# Altium project CSN_v4_2.PrjPCB
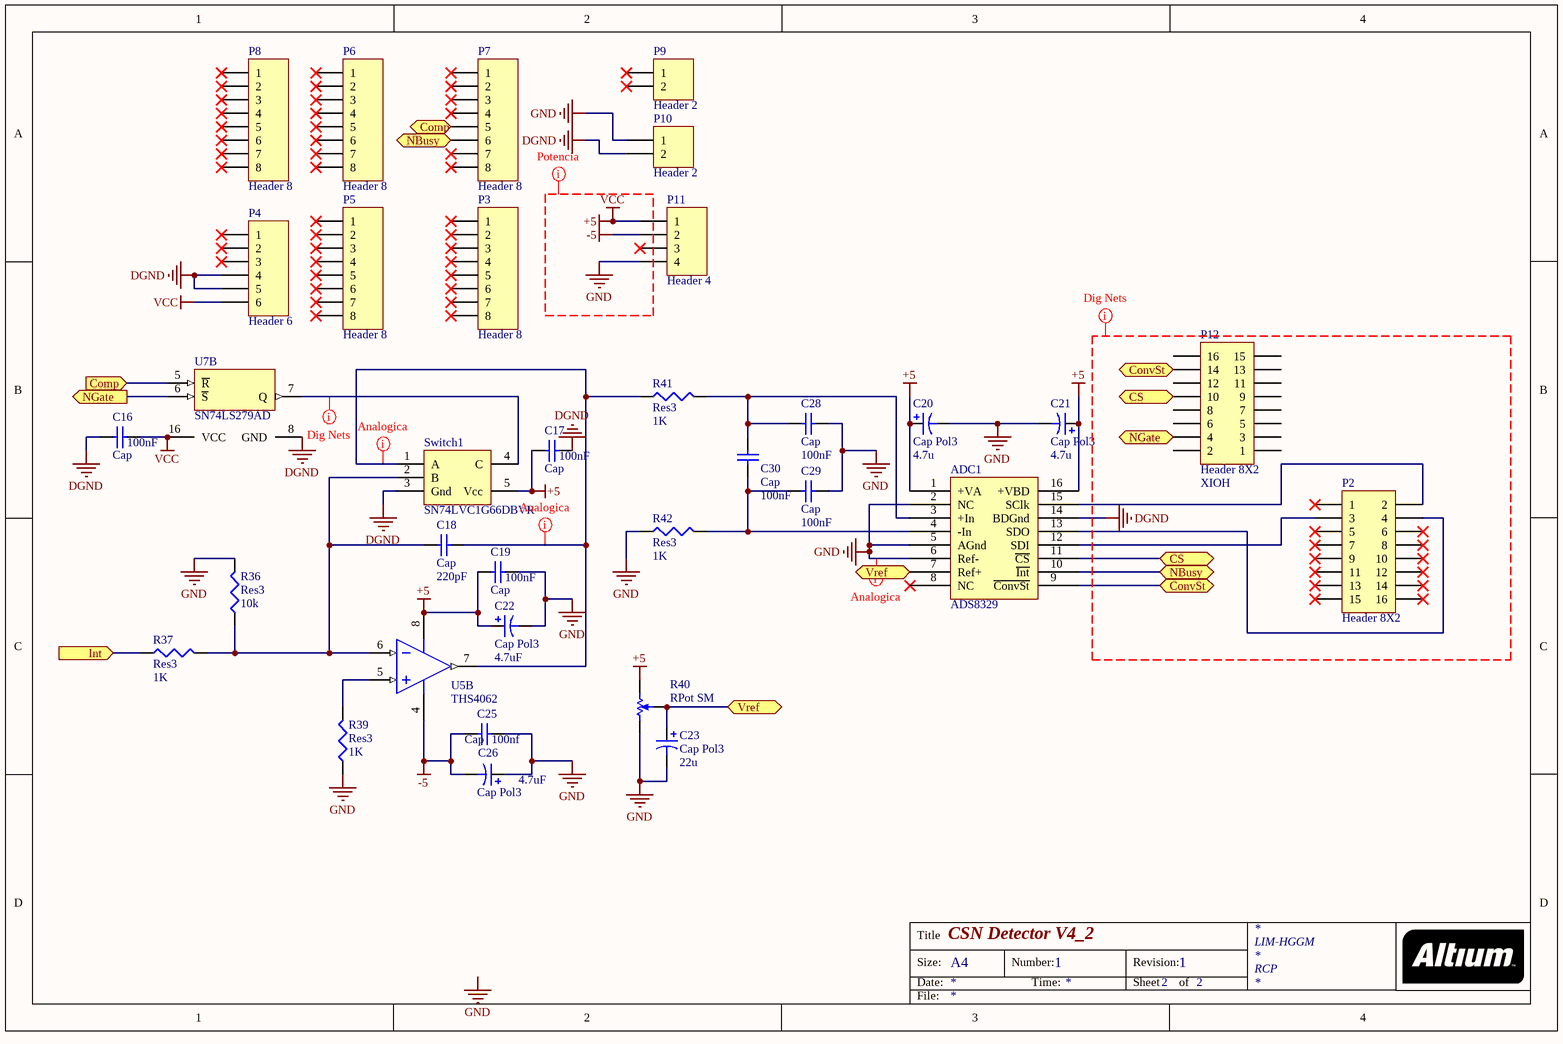
[diagram p0: Logica_ADC.SchDoc]
2 sheets, 92 parts. Net scope: flat (ports and power ports of the same name join across sheets).
Board file: PCB_CSN_V4_1.PcbDoc
Sheets:
  Logica_ADC.SchDoc
  Acond_Elec.SchDoc

## Sheet Logica_ADC.SchDoc: CSN Detector V4_2
size A4; CheckedBy: RCP; Author: RCP; DrawnBy: RCP; Address1: LIM-HGGM; Address3: RCP; DocumentNumber: 1; Revision: 1; SheetNumber: 2; SheetTotal: 2; PageSetup: Record=PageOptions|CenterHorizontal=True|CenterVertical=True|PrintScale=0.97|XCorrection=1.00|YCorrection=1.00|PrintKind=0|BorderSize=5000000|LeftOffset=0|BottomOffset=0|Orientation=2|PaperLength=1000|PaperWidth=1000|Scale=100|PaperSource=7|PrintQuality=-4|MediaType=1|DitherType=10|PaperKind=A4|PrintScaleMode=1

### Parts
ADC1  ADS8329  [PW-R-PDSO-G16]
C16  Cap  value 100nF  [6-0805_N]
C17  Cap  value 100nF  [6-0805_N]
C18  Cap  value 220pF  [6-0805_N]
C19  Cap  value 100nF  [6-0805_N]
C20  Cap Pol3  value 4.7u  [6-0805_N]
C21  Cap Pol3  value 4.7u  [6-0805_N]
C22  Cap Pol3  value 4.7uF  [6-0805_N]
C23  Cap Pol3  value 22u  [6-0805_N]
C25  Cap  value 100nf  [6-0805_N]
C26  Cap Pol3  value 4.7uF  [6-0805_N]
C28  Cap  value 100nF  [6-0805_N]
C29  Cap  value 100nF  [6-0805_N]
C30  Cap  value 100nF  [6-0805_N]
P2  Header 8X2  [HDR2X8]
P3  Header 8  [HDR1X8]
P4  Header 6  [HDR1X6]
P5  Header 8  [HDR1X8]
P6  Header 8  [HDR1X8]
P7  Header 8  [HDR1X8]
P8  Header 8  [HDR1X8]
P9  Header 2  [HDR1X2]
P10  Header 2  [HDR1X2]
P11  Header 4  [HDR1X4]
P12  Header 8X2  Con_Arduino: XIOH  [HDR2X8]
R36  Res3  value 10k  [6-0805_N]
R37  Res3  value 1K  [6-0805_N]
R39  Res3  value 1K  [6-0805_N]
R40  RPot SM  [POT4MM-2]
R41  Res3  value 1K  [6-0805_N]
R42  Res3  value 1K  [6-0805_N]
Switch1  SN74LVC1G66DBVR  [SOT23-5_N]
U5  THS4062  [S8_N]  (part B of 2)
U7  SN74LS279AD  [D016_N]  (part B of 4)

### Ports
Comp (in), Comp (out), ConvSt, CS, Int (in), NBusy, NGate (out), Vref

### Nets
+5: ADC1.1(+VA) ADC1.16(+VBD) C16.1 C17.2 C19.2 C20.1 C21.1 C22.1 P4.6 P11.1 R40.CW(+) Switch1.5(Vcc) U5.8(V+) U7.16(VCC)  [also labelled VCC]
-5: C25.1 C26.2 P11.2 U5.4(V-)
DGND: ADC1.2(NC) ADC1.5(AGnd) ADC1.6(Ref-) ADC1.14(BDGnd) C16.2 C17.1 C19.1 C20.2 C21.2 C22.2 C23.2 C25.2 C26.1 C28.1 C29.1 P4.4 P4.5 P10.1 P10.2 P11.4 R36.2 R39.1 R40.CCW(-) R42.1 Switch1.3(Gnd) U7.8(GND)  [also labelled GND]
NetADC1_3: ADC1.3(+In) C28.2 C30.2 R41.2
NetADC1_4: ADC1.4(-In) C29.2 C30.1 R42.2
NetADC1_7: ADC1.7(Ref+) C23.1 R40.W ; port Vref
NetADC1_9: ADC1.9(~{ConvSt}) P12.14 ; port ConvSt
NetADC1_10: ADC1.10(~{Int}) P7.6 ; port NBusy
NetADC1_11: ADC1.11(~{CS}) P12.10 ; port CS
NetADC1_12: ADC1.12(SDI) P2.3
NetADC1_13: ADC1.13(SDO) P2.4
NetADC1_15: ADC1.15(SClk) P2.2
NetC18_1: C18.1 R36.1 R37.2 Switch1.2(B) U5.6(IN-)
NetC18_2: C18.2 R41.1 Switch1.1(A) U5.7(OUT)
NetP7_5: P7.5 U7.5(~{R}) ; port Comp
NetP12_4: P12.4 U7.6(~{S}) ; port NGate
NetR5_2: R37.1 ; port Int
NetR39_2: R39.2 U5.5(IN+)
NetSwitch1_4: Switch1.4(C) U7.7(Q)

Not connected (* = marked no-connect by the designer): ADC1 8(NC)*; P2 1* 5* 6* 7* 8* 9* 10* 11* 12* 13* 14* 15* 16*; P3 1* 2* 3* 4* 5* 6* 7* 8*; P4 1* 2* 3*; P5 1* 2* 3* 4* 5* 6* 7* 8*; P6 1* 2* 3* 4* 5* 6* 7* 8*; P7 1* 2* 3* 4* 7* 8*; P8 1* 2* 3* 4* 5* 6* 7* 8*; P9 1* 2*; P11 3*; P12 1 2 3 5 6 7 8 9 11 12 13 15 16

### Layout directives
net class digital: DGND, NetSwitch1_4
net class potencia: +5, -5, GND, VCC
net class analog: DGND, NetC18_2

### Notes on the sheet
- Labels drawn without touching a wire or pin: GND
- Title
- Size:
- Date:
- A4
- Number:
- Time:
- Revision:
- Sheet
- of
- File:

### Library data of the parts
C16-C19 C25 C28-C30 = Cap: Capacitor; Published: 8-Jun-2000; LatestRevisionDate: 17-Jul-2002; LatestRevisionNote: Re-released for DXP Platform.; PackageReference: RAD-0.3; Publisher: Altium Limited; PackageDescription: Radial Cap, Thru-Hole; 2 Leads; 0.3 in Pin Spacing
C20-C23 C26 = Cap Pol3: Polarized Capacitor (Surface Mount); Published: 8-Jun-2000; LatestRevisionDate: 29-May-2009; LatestRevisionNote: IPC-7351 Footprint Added.; PackageReference: C0805; Publisher: Altium Limited; PackageDescription: Chip Capacitor
P2 P12 = Header 8X2: Header, 8-Pin, Dual row; LatestRevisionDate: 17-Jul-2002; LatestRevisionNote: Re-released for DXP Platform.; Publisher: Altium Limited
P3 P5-P8 = Header 8: Header, 8-Pin; LatestRevisionDate: 17-Jul-2002; LatestRevisionNote: Re-released for DXP Platform.; Publisher: Altium Limited
P4 = Header 6: Header, 6-Pin; LatestRevisionDate: 17-Jul-2002; LatestRevisionNote: Re-released for DXP Platform.; Publisher: Altium Limited
P9 P10 = Header 2: Header, 2-Pin; LatestRevisionDate: 17-Jul-2002; LatestRevisionNote: Re-released for DXP Platform.; Publisher: Altium Limited
P11 = Header 4: Header, 4-Pin; LatestRevisionDate: 17-Jul-2002; LatestRevisionNote: Re-released for DXP Platform.; Publisher: Altium Limited
R36 R37 R39 R41 R42 = Res3: Resistor; Published: 8-Jun-2000; LatestRevisionDate: 29-May-2009; LatestRevisionNote: IPC-7351 Footprint Added.; PackageReference: J1-0603; Publisher: Altium Limited; PackageDescription: Chip Resistor
R40 = RPot SM: Square Trimming Potentiometer; Published: 17-Dec-2003; DatasheetVersion: Oct-2003; PackageReference: POT4MM-2; Publisher: Altium Limited; PackageDescription: Square Trimming Potentiometer; ComponentLink1Description: Manufacturer Link; ComponentLink1URL: http://bourns.com/2/search.html
U5 = LT1253CS8: Low Cost Dual Video Amplifier; Note: 1003; Published: 8-Jun-2000; LatestRevisionDate: 13-Apr-2006; LatestRevisionNote: IPC-7351 Footprint Added.; DatasheetVersion: 1996; PackageReference: S8; Publisher: Altium Limited; PackageDescription: 8-Pin Small Outline Integrated Circuit 1.27 mm Pitch; Code_JEDEC: MS-012-AA; Code_IPC: SOIC127P600-8; ComponentLink1Description: Manufacturer Link; ComponentLink1URL: http://www.linear.com/; ComponentLink2Description: Datasheet; ComponentLink2URL: http://www.linear.com/pc/downloadDocument.do?navId=H0,C1,C1154,C1009,C1022,P1423,D1129
U7 = SN74LS279AD: Quadruple S-R Latches; Published: 8-Jun-2000; LatestRevisionDate: 13-Apr-2006; LatestRevisionNote: IPC-7351 Footprint Added.; DatasheetVersion: Mar-1988; PackageVersion: Jan-1998; PackageReference: D016; Publisher: Altium Limited; PackageDescription: 16-Pin Small Outline Integrated Circuit 1.27 mm Pitch; Code_IPC: SOIC127P600-16; ComponentLink1Description: Manufacturer Link; ComponentLink1URL: http://www.ti.com/; ComponentLink2Description: Datasheet; ComponentLink2URL: http://www-s.ti.com/sc/ds/sn54279.pdf

## Sheet Acond_Elec.SchDoc: CSN Detector V4_1
size A4; Author: RCP; DrawnBy: RCP; Address1: LIM-HGGM; Address3: RCP; DocumentNumber: 1; Revision: 1; SheetNumber: 1; SheetTotal: 2; PageSetup: Record=PageOptions|CenterHorizontal=True|CenterVertical=True|PrintScale=0.97|XCorrection=1.00|YCorrection=1.00|PrintKind=0|BorderSize=5000000|LeftOffset=0|BottomOffset=0|Orientation=2|PaperLength=2970|PaperWidth=2100|Scale=100|PaperSource=7|PrintQuality=600|MediaType=1|DitherType=10|PaperKind=A4|PrintScaleMode=1
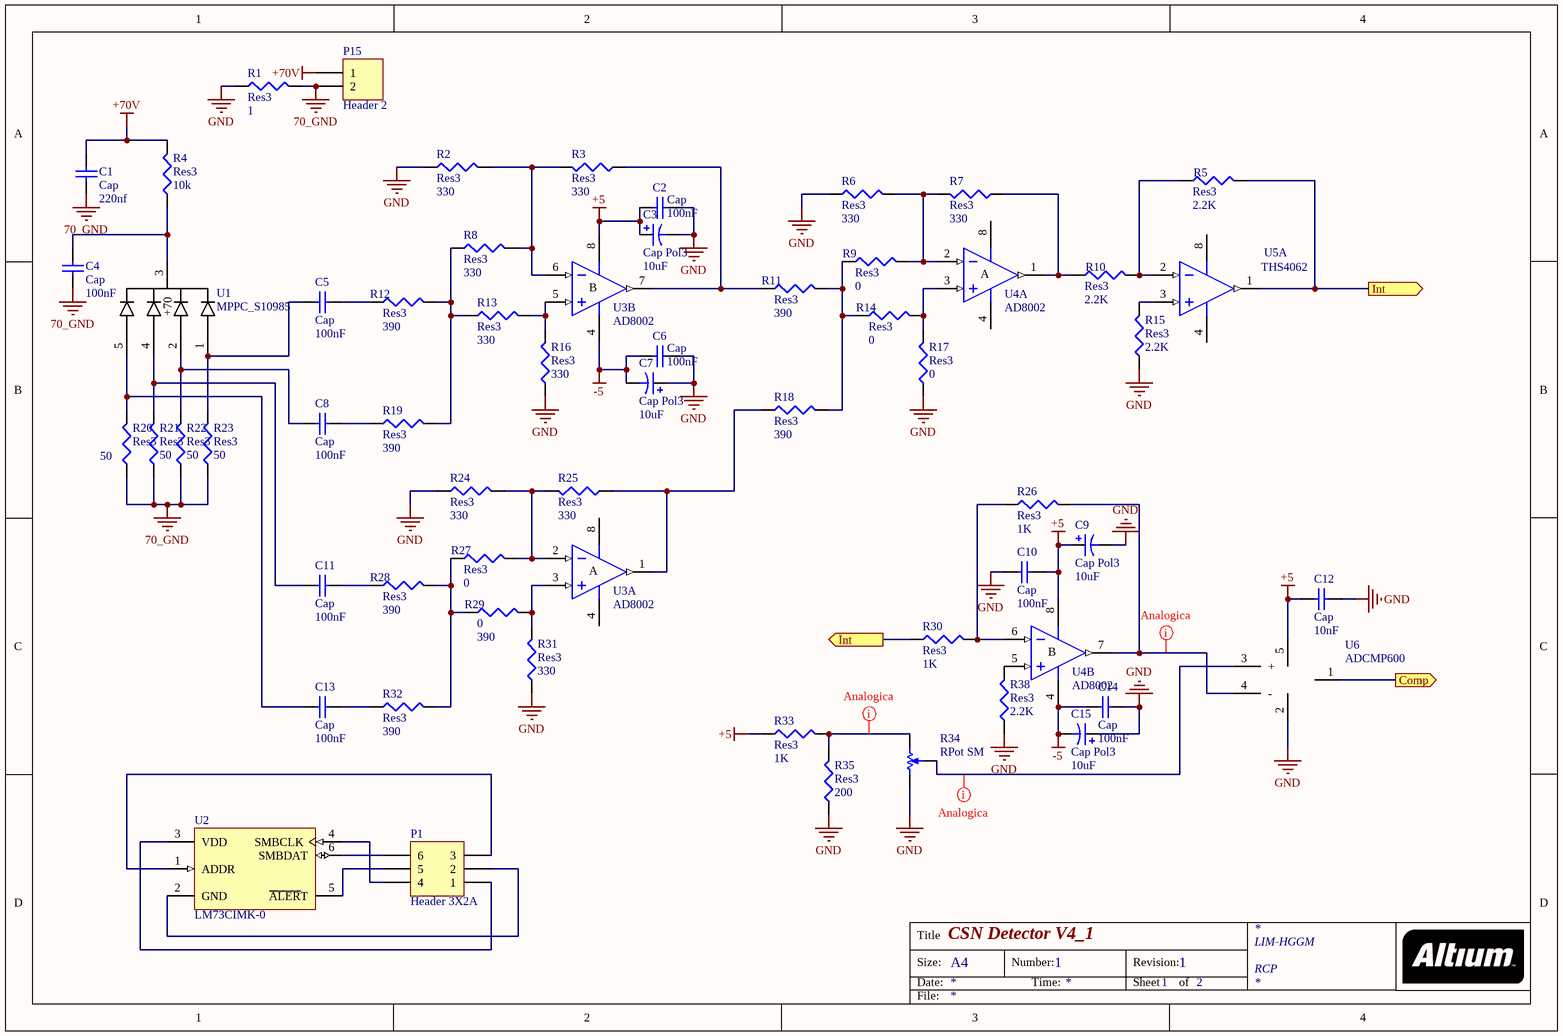
[diagram p1: Acond_Elec.SchDoc]

### Parts
C1  Cap  value 220nf  [C0805]
C2  Cap  value 100nF  [6-0805_N]
C3  Cap Pol3  value 10uF  [6-0805_N]
C4  Cap  value 100nF  [C0805]
C5  Cap  value 100nF  [C0805]
C6  Cap  value 100nF  [6-0805_N]
C7  Cap Pol3  value 10uF  [6-0805_N]
C8  Cap  value 100nF  [C0805]
C9  Cap Pol3  value 10uF  [6-0805_N]
C10  Cap  value 100nF  [6-0805_N]
C11  Cap  value 100nF  [C0805]
C12  Cap  value 10nF  [6-0805_N]
C13  Cap  value 100nF  [C0805]
C14  Cap  value 100nF  [6-0805_N]
C15  Cap Pol3  value 10uF  [6-0805_N]
P1  Header 3X2A  [HDR2X3_CEN]
P15  Header 2  [HDR1X2]
R1  Res3  value 1  [6-0805_N]
R2  Res3  value 330  [6-0805_N]
R3  Res3  value 330  [6-0805_N]
R4  Res3  value 10k  [6-0805_N]
R5  Res3  value 2.2K  [6-0805_N]
R6  Res3  value 330  [6-0805_N]
R7  Res3  value 330  [6-0805_N]
R8  Res3  value 330  [6-0805_N]
R9  Res3  value 0  [6-0805_N]
R10  Res3  value 2.2K  [6-0805_N]
R11  Res3  value 390  [6-0805_N]
R12  Res3  value 390  [6-0805_N]
R13  Res3  value 330  [6-0805_N]
R14  Res3  value 0  [6-0805_N]
R15  Res3  value 2.2K  [6-0805_N]
R16  Res3  value 330  [6-0805_N]
R17  Res3  value 0  [6-0805_N]
R18  Res3  value 390  [6-0805_N]
R19  Res3  value 390  [6-0805_N]
R20  Res3  value 50  [6-0805_N]
R21  Res3  value 50  [6-0805_N]
R22  Res3  value 50  [6-0805_N]
R23  Res3  value 50  [6-0805_N]
R24  Res3  value 330  [6-0805_N]
R25  Res3  value 330  [6-0805_N]
R26  Res3  value 1K  [6-0805_N]
R27  Res3  value 0  [6-0805_N]
R28  Res3  value 390  [6-0805_N]
R29  0  value 390  [6-0805_N]
R30  Res3  value 1K  [6-0805_N]
R31  Res3  value 330  [6-0805_N]
R32  Res3  value 390  [6-0805_N]
R33  Res3  value 1K  [6-0805_N]
R34  RPot SM  [POT4MM-2]
R35  Res3  value 200  [6-0805_N]
R38  Res3  value 2.2K  [6-0805_N]
U1  MPPC_S10985  [S10985_HAM]
U2  LM73CIMK-0  [MK06A_N]
U3  AD8002  [SO-8_M]  (parts A,B of 2)
U4  AD8002  [SO-8_M]  (parts A,B of 2)
U5  THS4062  [S8_N]  (part A of 2)
U6  ADCMP600  [SOT23-5_N]

### Ports
Comp (out), Int (out)

### Nets
70_GND: C1.1 C4.1 P15.2 R1.2 R20.1 R21.1 R22.1 R23.1
+5: C2.2 C3.1 C9.1 C10.2 C12.1 R33.1 U3.8(V+) U4.8(V+) U5.8(V+) U6.5
+70V: C1.2 P15.1 R4.2
-5: C6.2 C7.2 C14.1 C15.2 U3.4(V-) U4.4(V-) U5.4(V-)
GND: C2.1 C3.2 C6.1 C7.1 C9.2 C10.1 C12.2 C14.2 C15.1 R1.1 R2.1 R6.1 R15.1 R16.1 R17.1 R24.1 R31.1 R34.CCW(-) R35.1 R38.1 U6.2  [project net DGND]
NetC4_2: C4.2 R4.1 U1.3(+70)
NetC5_1: C5.1 R23.2 U1.1(Pin1)
NetC5_2: C5.2 R12.1
NetC8_1: C8.1 R22.2 U1.2(Pin2)
NetC8_2: C8.2 R19.1
NetC11_1: C11.1 R21.2 U1.4
NetC11_2: C11.2 R28.1
NetC13_1: C13.1 R20.2 U1.5
NetC13_2: C13.2 R32.1
NetP1_1: P1.1 U2.3(VDD)
NetP1_2: P1.2 U2.2(GND)
NetP1_3: P1.3 U2.1(ADDR)
NetP1_4: P1.4 U2.4(SMBCLK)
NetP1_5: P1.5 U2.5(~{ALER}T)
NetP1_6: P1.6 U2.6(SMBDAT)
NetP7_5: U6.1 ; port Comp
NetR2_2: R2.2 R3.2 R8.2 U3.6(IN-)
NetR3_1: R3.1 R11.1 U3.7(OUT)
NetR5_1: R5.1 R10.2 U5.2(IN-)
NetR5_2: R5.2 R30.1 U5.1(OUT) ; port Int
NetR6_2: R6.2 R7.2 R9.2 U4.2(IN-)
NetR7_1: R7.1 R10.1 U4.1(OUT)
NetR8_1: R8.1 R12.2 R13.1 R19.2
NetR9_1: R9.1 R11.2 R14.1 R18.2
NetR13_2: R13.2 R16.2 U3.5(IN+)
NetR14_2: R14.2 R17.2 U4.3(IN+)
NetR15_2: R15.2 U5.3(IN+)
NetR18_1: R18.1 R25.1 U3.1(OUT)
NetR24_2: R24.2 R25.2 R27.2 U3.2(IN-)
NetR26_1: R26.1 R30.2 U4.6(IN-)
NetR26_2: R26.2 U4.7(OUT) U6.4(-)
NetR27_1: R27.1 R28.2 R29.1 R32.2
NetR29_2: R29.2 R31.2 U3.3(IN+)
NetR33_2: R33.2 R34.CW(+) R35.2
NetR34_W: R34.W U6.3(+)
NetR38_2: R38.2 U4.5(IN+)

### Layout directives
net class analog: NetR26_2, NetR33_2, NetR34_W

### Notes on the sheet
- Title
- Size:
- Date:
- A4
- Number:
- Time:
- Revision:
- Sheet
- of
- File:
- (in symbol AD8002AR, part A) A
- (in symbol AD8002AR, part B) B

### Library data of the parts
C1 C2 C4-C6 C8 C10-C14 = Cap: Capacitor; Published: 8-Jun-2000; LatestRevisionDate: 17-Jul-2002; LatestRevisionNote: Re-released for DXP Platform.; PackageReference: RAD-0.3; Publisher: Altium Limited; PackageDescription: Radial Cap, Thru-Hole; 2 Leads; 0.3 in Pin Spacing
C3 C7 C9 C15 = Cap Pol3: Polarized Capacitor (Surface Mount); Published: 8-Jun-2000; LatestRevisionDate: 29-May-2009; LatestRevisionNote: IPC-7351 Footprint Added.; PackageReference: C0805; Publisher: Altium Limited; PackageDescription: Chip Capacitor
P1 = Header 3X2A: Header, 3-Pin, Dual row; LatestRevisionDate: 17-Jul-2002; LatestRevisionNote: Re-released for DXP Platform.; Publisher: Altium Limited
P15 = Header 2: Header, 2-Pin; LatestRevisionDate: 17-Jul-2002; LatestRevisionNote: Re-released for DXP Platform.; Publisher: Altium Limited
R1-R33 R35 R38 = Res3: Resistor; Published: 8-Jun-2000; LatestRevisionDate: 29-May-2009; LatestRevisionNote: IPC-7351 Footprint Added.; PackageReference: J1-0603; Publisher: Altium Limited; PackageDescription: Chip Resistor
R34 = RPot SM: Square Trimming Potentiometer; Published: 17-Dec-2003; DatasheetVersion: Oct-2003; PackageReference: POT4MM-2; Publisher: Altium Limited; PackageDescription: Square Trimming Potentiometer; ComponentLink1Description: Manufacturer Link; ComponentLink1URL: http://bourns.com/2/search.html
U2 = LM73CIMK-0: 2.7V, 11- to 14- Bit Digital Temperature Sensor with 2-Wire Interface, 6-pin Tiny SOT23; Manufacturer: National Semiconductor; PackageTopMarking: T730*XTT; PowerWise: Y; CompType: Temp Sensor IC; Published: 4-Dec-2008; DatasheetVersion: May-2009; PackageVersion: revE, Nov-2008; PackageReference: MK06A; Publisher: Altium Limited; PackageDescription: Molded TSOT, 2.97 x 1.65 x 0.87mm Body, 6 Lead, 0.95mm Pitch; Supplier 1: Farnell; Supplier Part Number 1: 1312598; PartNumber: LM73CIMK-0; RoHS: Y; PinCount: 6; Code_JEDEC: MO-193-AA; Code_IPC: SOT26A-6; ComponentLink1Description: LM73 Datasheet; ComponentLink1URL: http://www.national.com/ds/LM/LM73.pdf; ComponentLink2Description: LM73 Web Page; ComponentLink2URL: http://www.national.com/pf/LM/LM73.html; ComponentLink3Description: MK06A Package Page; ComponentLink3URL: http://www.national.com/packaging/folders/mk06a.html
U3 U4 = AD8002AR: Dual 600MHz, 50mW Current Feedback Amplifier; Published: 8-Jun-2000; LatestRevisionDate: 13-Apr-2006; LatestRevisionNote: IPC-7351 Footprint Added.; DatasheetVersion: REV. C 1999; PackageVersion: revA; PackageReference: SO-8; Publisher: Altium Limited; PackageDescription: 8-Pin Small Outline Integrated Circuit 1.27 mm Pitch; Code_JEDEC: MS-012-AA; Code_IPC: SOIC127P600-8; ComponentLink1Description: Manufacturer Link; ComponentLink1URL: http://www.analog.com/en/prod/0,,759_786_AD8002%2C00.html; ComponentLink2Description: Datasheet; ComponentLink2URL: http://www.analog.com/UploadedFiles/Data_Sheets/147523773AD8002_d.pdf
U5 = LT1253CS8: as U5 on sheet Logica_ADC; Published: 8-Jun-2000; LatestRevisionDate: 13-Apr-2006; LatestRevisionNote: IPC-7351 Footprint Added.; DatasheetVersion: 1996; PackageReference: S8; Publisher: Altium Limited; PackageDescription: 8-Pin Small Outline Integrated Circuit 1.27 mm Pitch; Code_JEDEC: MS-012-AA; Code_IPC: SOIC127P600-8; ComponentLink1Description: Manufacturer Link; ComponentLink1URL: http://www.linear.com/; ComponentLink2Description: Datasheet; ComponentLink2URL: http://www.linear.com/pc/downloadDocument.do?navId=H0,C1,C1154,C1009,C1022,P1423,D1129

## Nets that join several sheets
+5: Logica_ADC (14 pins), Acond_Elec (10 pins)
-5: Logica_ADC (C25.1 C26.2 P11.2 U5.4), Acond_Elec (7 pins)
DGND: Logica_ADC (26 pins), Acond_Elec (21 pins)
NetP7_5: Logica_ADC (P7.5 U7.5), Acond_Elec (U6.1)
NetR5_2: Logica_ADC (R37.1), Acond_Elec (R5.2 R30.1 U5.1)